# EAGLE design Tacho_SeedBauteile (EAGLE 6.5.0)
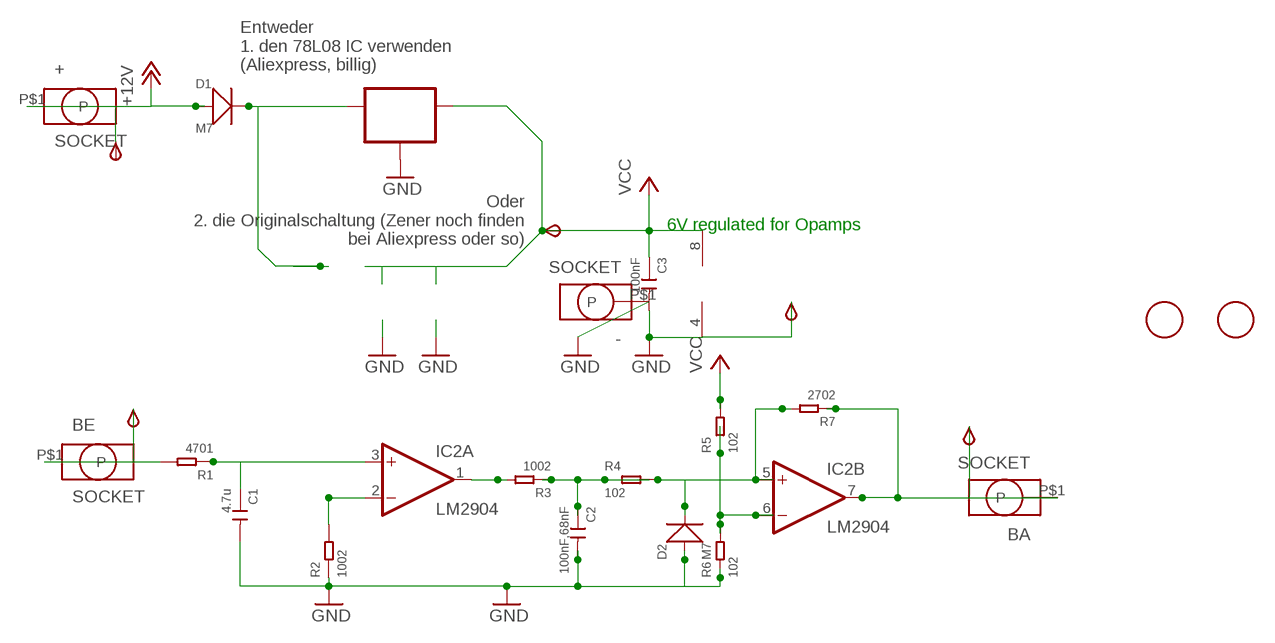
[diagram p0: schematic, sheet 1]

## Parts
6V  TPSB2.0  [B2.0]
+  SOCKET  [ID2.5MM]
+12V  TPSB2.0  [B2.0]
-  SOCKET  [ID2.5MM]
AUS  TPSB2.0  [B2.0]
BA  SOCKET  [ID2.5MM]
BE  SOCKET  [ID2.5MM]
C1  4.7u  CERAMIC-4.7UF-25V-10%-X5R(0805)  [C0805]
C2  100nF,68nF  CERAMIC-100NF-50V-10%-X7R(0805)  [C0805]
C3  100nF  CERAMIC-100NF-50V-10%-X7R(0805)  [C0805]
D1  M7  DIODE-GEN-PURPOSE-1KV-1A(DO-214AC)  [DO-214AC]
D2  M7  DIODE-GEN-PURPOSE-1KV-1A(DO-214AC)  [DO-214AC]
EIN  TPSB2.0  [B2.0]
FID1  FIDUCIAL  [FIDUCIAL_1MM]
FID2  FIDUCIAL  [FIDUCIAL_1MM]
GND  TPSB2.0  [B2.0]
IC1  5V/6V oder 8V Regler  78LXXSOT89_ROUND  [SOT89_ROUND]
IC2  LM2904  LM358D  [SO08]
R1  4701  SMD-RES-4.7K-5%-1/8W(0805)  [R0805]
R2  1002  SMD-RES-10K-1%-1/8W(0805)  [R0805]
R3  1002  SMD-RES-10K-1%-1/8W(0805)  [R0805]
R4  102  SMD-RES-1K-5%-1/8W(0805)  [R0805]
R5  102  SMD-RES-1K-5%-1/8W(0805)  [R0805]
R6  102  SMD-RES-1K-5%-1/8W(0805)  [R0805]
R7  2702  SMD-RES-4.7K-5%-1/8W(0805)  [R0805]

## Nets
+12V: +12V.TP(PP) +.P$1(P) D1.1(+)
+12V1: AUS.TP(PP) BA.P$1(P) IC2.7(B:OUT) R7.1
GND: -.P$1(P) C1.2 C2.2 C3.2 D2.1(+) GND.TP(PP) IC1.2(GND) IC1.2@1(GND) IC2.4(P:V-) R2.1 R6.1
N$5: D1.2(-) IC1.3(IN)
N$7: IC2.2(A:-IN) R2.2
N$23: BE.P$1(P) EIN.TP(PP) R1.2
N$24: C1.1 IC2.3(A:+IN) R1.1
N$92: IC2.1(A:OUT) R3.2
N$96: C2.1 R3.1 R4.1
N$97: D2.2(-) IC2.5(B:+IN) R4.2 R7.2
N$101: IC2.6(B:-IN) R5.1 R6.2
VCC: 6V.TP(PP) C3.1 IC1.1(OUT) IC2.8(P:V+) R5.2

## Notes on the sheet
- Entweder
  1. den 78L08 IC verwenden 
  (Aliexpress, billig)
- Oder
  2. die Originalschaltung (Zener noch finden
  bei Aliexpress oder so)
- 6V regulated for Opamps

## Library data of the parts
6V +12V AUS EIN GND = testpin_BMW:TPS: TEST PIN
+ - BA BE = Brotbox_Socket_Header:SOCKET
C1 = Seeed-Capacitor-2016:CERAMIC-4.7UF-25V-10%-X5R(0805): 302010146; MPN: CC0805KKX5R8BB475; VALUE: 4.7uf
C2 C3 = Seeed-Capacitor-2016:CERAMIC-100NF-50V-10%-X7R(0805): 302010165; MPN: CC0805KRX7R9BB104; VALUE: 100nf
D1 D2 = Diode-do214ac:DIODE-GEN-PURPOSE-1KV-1A(DO-214AC): 304010013; MPN: 1N4007; VALUE: 1N4007
FID1 FID2 = Fiducial:FIDUCIAL: For use by pick and place machines to calibrate the vision/machine, 1mm By microbuilder.eu
IC1 = 78LXX:78LXX
IC2 = linear_BMW:LM358: OP AMP also LM158; LM258; LM2904 Source: http://cache.national.com/ds/LM/LM158.pdf
R1 R7 = Seeed-Resistor-2016:SMD-RES-4.7K-5%-1/8W(0805): 301010306; MPN: RC0805JR-074K7L; VALUE: 4.7K
R2 R3 = Seeed-Resistor-2016:SMD-RES-10K-1%-1/8W(0805): 301010361; MPN: RC0805FR-0710KL; VALUE: 10K
R4-R6 = Seeed-Resistor-2016:SMD-RES-1K-5%-1/8W(0805): 301010311; MPN: RC0805JR-071KL; VALUE: 1K

## Board
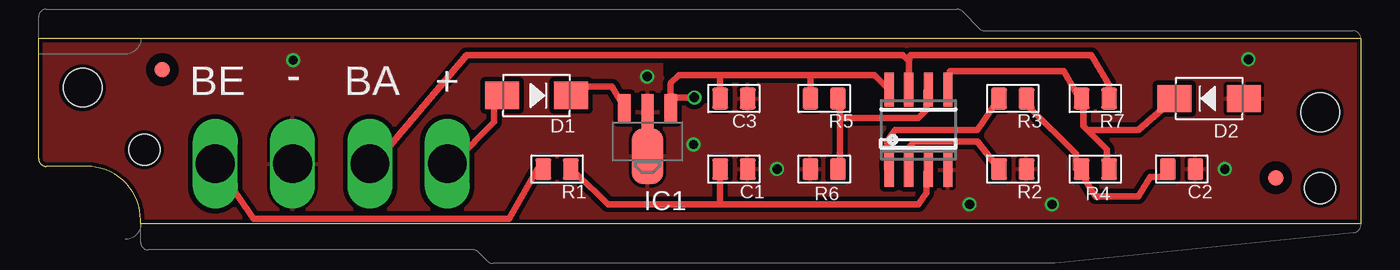
[diagram p1: board, top side]
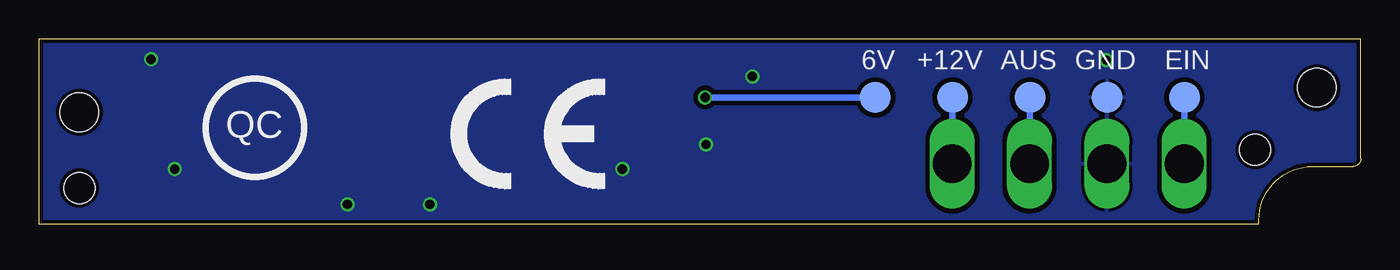
[diagram p2: board, bottom side, seen from below]

Size 85.5 x 12.01 mm. Coordinates in mm from the lower left corner, seen from the top.
Outline: 85.5,12.01 85.5,12
Outline: 85.5,12 85.5,0 6.59,0 6.59,0.24 arc90 3.1,3.74 0.5,3.74 arc-90 0,4.24 0,12 85.5,12
Copper layers (1*16): Top 0.035mm / dielectric 1.5mm / Bottom 0.035mm
Design rules "multi-cb_035um-cu *": minimum track width 12mil, minimum drill 12mil, track to track 12mil, track to pad 12mil, pad to pad 6mil, via to via 6mil, smd to smd 6mil, copper to edge 10mil, drill to drill 8mil, minimum pad ring 8mil, minimum via ring 6mil, stop-mask expansion 3mil, vias tented up to drill 0mil, thermal gap 8mil
Holes 2.5 mm at 2.85,8.83 82.87,7.23
Holes 2 mm at 6.83,4.82 82.87,2.33
tRestrict: area 40.4,9.6 to 55.8,10.4

### Footprints (pad centres in the part's own frame; a part is rotated, then mirrored left to right if it is on the bottom)
B2.0 = smd 2 x 2: TP 0,0
ID2.5MM = drill 2.5 long: P$1 0,0
C0805 = smd 1.397 x 1.016: 1 0,0.889; 2 0,-0.889
DO-214AC = smd 2.2 x 1.77: 1 -2.242,0; 2 2.242,0
FIDUCIAL_1MM = smd 1 x 1: 1 0,0
SOT89_ROUND = smd 0.8 x 1.8: 1 -1.499,-2.181; 3 1.499,-2.181 | smd 0.8 x 2.3: 2 0,-1.927 | smd 2.032 x 3.65: 2@1 0,0.94
SO08 = smd 0.6 x 2.2: 1 -1.905,-2.6; 2 -0.635,-2.6; 3 0.635,-2.6; 4 1.905,-2.6; 5 1.905,2.6; 6 0.635,2.6; 7 -0.635,2.6; 8 -1.905,2.6
R0805 = smd 1.397 x 1.016: 1 0,0.889; 2 0,-0.889

### Placement (x,y rotation side)
6V  31.4,8.2 0 bottom
+  26.42,3.9 90 top
+12V  26.4,8.2 0 bottom
-  16.42,3.9 90 top
AUS  21.4,8.2 0 bottom
BA  21.42,3.9 90 top
BE  11.42,3.9 90 top
C1  44.96,3.56 90 top
C2  73.91,3.56 90 top
C3  44.96,8.13 90 top
D1  32.2,8.33 0 top
D2  75.69,8.13 180 top
EIN  11.4,8.2 0 bottom
FID1  80,3 0 top
FID2  8,10 0 top
GND  16.4,8.2 0 bottom
IC1  39.37,5.33 180 top
IC2  56.9,6.1 0 top
R1  33.53,3.56 270 top
R2  62.99,3.56 270 top
R3  62.99,8.13 270 top
R4  68.33,3.56 90 top
R5  50.8,8.13 270 top
R6  50.8,3.56 90 top
R7  68.33,8.13 270 top
U$1  [CE_10.00]  58.91,2.2 0 bottom

### Tracks (layer width: path | path; a pad name or v marks a point on that pad's centre or on a via)
+12V
  Top 0.305: 29.46,8.13 D1.1 | 26.92,4.06 +.P$1
  Top 0.406: 29.46,8.13 29.46,6.6 26.92,4.06
  Bottom 0.406: +12V.TP 26.4,3.92 +.P$1
+12V1
  Top 0.305: 21.84,4.06 BA.P$1
  Top 0.406: 21.84,4.06 27.69,10.92 55.88,10.92 56.26,10.54 | IC2.7 56.26,10.54 | R7.1 69.22,9.02 68.07,10.92 56.39,10.92 56.26,10.54
  Bottom 0.406: AUS.TP 21.4,3.92 BA.P$1
GND  (via drill 0.6)
  other vias: 47.75,3.56 65.53,1.27 78.23,10.67 76.71,3.56 60.2,1.27 39.35,9.56 42.35,5.16 16.46,10.61
  pour Top (rank 3): 85.77,12.19 0.06,12.19 0.06,4.06 4.18,3.81 6.85,-0.13 85.52,-0.38
  pour Bottom: 85.62,12.19 -0.44,12.19 -0.19,-0.38 85.77,-0.38
N$5
  Top 0.305: 35.31,8.89 D1.2
  Top 0.406: 35.31,8.89 37.08,8.89 IC1.3
N$7
  Top 0.406: R2.2 60.71,5.33 56.64,5.33 56.39,5.08 IC2.2
N$23
  Top 0.305: 32.26,3.56 R1.2 | 11.68,3.56 BE.P$1
  Top 0.406: 32.26,3.56 30.43,0.32 13.92,0.32 11.68,3.56
  Bottom 0.406: BE.P$1 11.42,8.18 EIN.TP
N$24
  Top 0.406: R1.1 36.07,2.03 36.83,1.27 44.2,1.27 | 44.2,1.27 56.9,1.27 57.4,2.03 57.4,3.37 IC2.3 | C1.1 44.07,1.4 44.2,1.27
N$92
  Top 0.305: 54.86,3.56 IC2.1
  Top 0.406: R3.2 60.71,6.1 55.37,6.1 54.86,5.33 54.86,3.56
N$96
  Top 0.305: 67.06,3.56 R4.1 67.56,3.05 | 64.01,7.62 R3.1 | 72.64,3.05 C2.1
  Top 0.406: 67.06,3.56 67.06,4.57 64.01,7.62 | 72.64,3.05 71.88,3.05 71.12,1.78 68.33,1.78 67.56,3.05
N$97
  Top 0.305: 67.31,8.13 R7.2 | 73.66,7.62 D2.2
  Top 0.406: 67.31,8.13 66.29,9.91 58.93,9.91 IC2.5 | R7.2 67.56,7.75 67.56,6.35 67.82,6.1 | D2.2 73.15,7.87 71.12,6.1 67.82,6.1 | 67.82,6.1 69.09,4.83 69.09,3.43 R4.2
N$101
  Top 0.305: 51.82,3.56 R6.2 | 51.82,8.13 R5.1 | 57.4,8.64 IC2.6
  Top 0.406: 51.82,8.13 51.82,6.86 | 51.82,6.86 51.82,3.56 | 57.4,8.64 57.4,7.37 56.9,6.86 51.82,6.86
VCC  (via drill 0.6)
  Top 0.406: IC1.1 40.87,8.4 | 40.87,8.4 40.87,9.04 40.89,9.14 41.4,9.65 44.2,9.65 | 44.2,9.65 49.78,9.65 | 49.78,8.64 R5.2 49.91,9.53 49.78,9.65 | 49.78,9.65 54.03,9.65 IC2.8 | C3.1 44.07,9.53 44.2,9.65 | v42.4,8.2 41.07,8.2 40.87,8.4
  Bottom 0.406: 6V.TP v42.4,8.2

### Text on the board
bPlace: QC